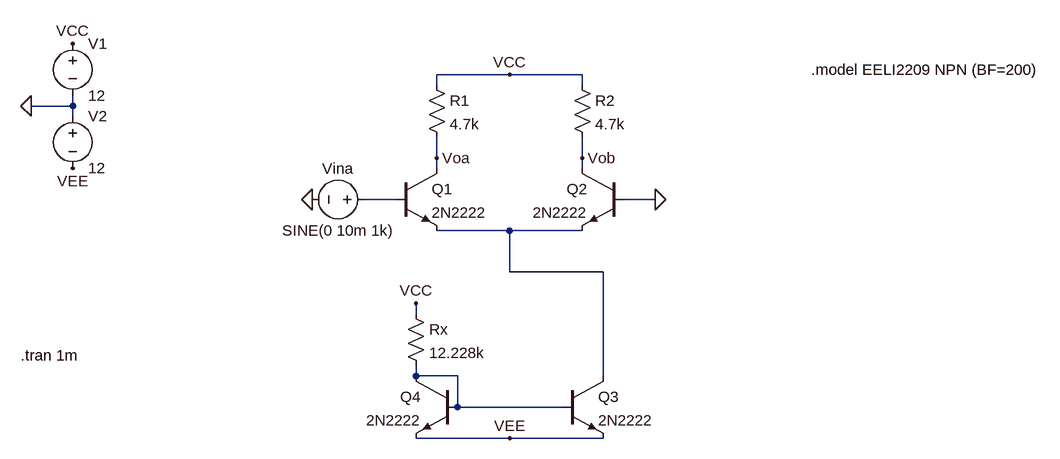
[diagram p0: schematic atividadeVaner.asc]
atividadeVaner.asc, the LTspice schematic file:
Version 4
SHEET 1 1432 716
WIRE 592 112 480 112
WIRE 704 112 592 112
WIRE 480 128 480 112
WIRE 704 128 704 112
WIRE -80 160 -80 144
WIRE -80 160 -144 160
WIRE -80 176 -80 160
WIRE 480 240 480 208
WIRE 704 240 704 208
WIRE 480 256 480 240
WIRE 704 256 704 240
WIRE 416 304 368 304
WIRE 816 304 768 304
WIRE 592 352 480 352
WIRE 704 352 592 352
WIRE 592 416 592 352
WIRE 736 416 592 416
WIRE 448 480 448 464
WIRE 448 576 448 560
WIRE 512 576 448 576
WIRE 736 576 736 416
WIRE 512 624 512 576
WIRE 672 624 512 624
WIRE 592 672 448 672
WIRE 736 672 592 672
FLAG -80 256 VEE
FLAG -80 64 VCC
FLAG -144 160 0
FLAG 592 672 VEE
FLAG 592 112 VCC
FLAG 288 304 0
FLAG 704 240 Vob
FLAG 480 240 Voa
FLAG 816 304 0
FLAG 448 464 VCC
SYMBOL voltage -80 48 R0
WINDOW 123 0 0 Left 0
WINDOW 39 0 0 Left 0
SYMATTR InstName V1
SYMATTR Value 12
SYMBOL voltage -80 160 R0
WINDOW 123 0 0 Left 0
WINDOW 39 0 0 Left 0
SYMATTR InstName V2
SYMATTR Value 12
SYMBOL npn 416 256 R0
SYMATTR InstName Q1
SYMATTR Value 2N2222
SYMBOL npn 768 256 M0
SYMATTR InstName Q2
SYMATTR Value 2N2222
SYMBOL res 464 112 R0
SYMATTR InstName R1
SYMATTR Value 4.7k
SYMBOL res 688 112 R0
SYMATTR InstName R2
SYMATTR Value 4.7k
SYMBOL voltage 384 304 R90
WINDOW 0 -32 56 VBottom 2
WINDOW 3 32 56 VTop 2
WINDOW 123 0 0 Left 0
WINDOW 39 0 0 Left 0
SYMATTR InstName Vina
SYMATTR Value SINE(0 10m 1k)
SYMBOL npn 672 576 R0
SYMATTR InstName Q3
SYMATTR Value 2N2222
SYMBOL npn 512 576 M0
SYMATTR InstName Q4
SYMATTR Value 2N2222
SYMBOL res 432 464 R0
SYMATTR InstName Rx
SYMATTR Value 12.228k
TEXT -160 544 Left 2 !.tran 1m
TEXT 1056 104 Left 2 !.model EELI2209 NPN (BF=200)

The netlist it stands for:
* atividadeVaner.asc
V1 VCC 0 12
V2 0 VEE 12
Q1 Voa N001 N002 0 2N2222
Q2 Vob 0 N002 0 2N2222
R1 VCC Voa 4.7k
R2 VCC Vob 4.7k
Vina N001 0 SINE(0 10m 1k)
Q3 N002 N003 VEE 0 2N2222
Q4 N003 N003 VEE 0 2N2222
Rx VCC N003 12.228k
.model NPN NPN
.model PNP PNP
.lib standard.bjt
.tran 1m
.model EELI2209 NPN (BF=200)
.backanno
.end